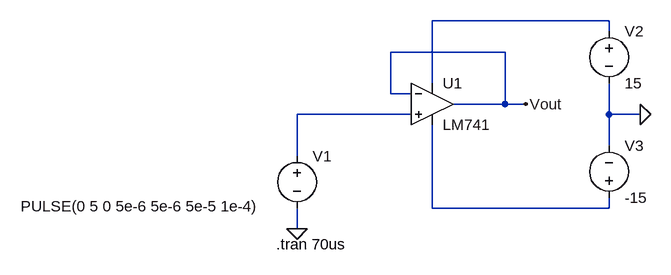
[diagram p0: schematic voltage_follower.asc]
voltage_follower.asc, the LTspice schematic file:
Version 4
SHEET 1 880 680
WIRE 480 32 208 32
WIRE 480 48 480 32
WIRE 320 80 144 80
WIRE 208 128 208 32
WIRE 144 144 144 80
WIRE 176 144 144 144
WIRE 320 160 320 80
WIRE 320 160 240 160
WIRE 352 160 320 160
WIRE 176 176 0 176
WIRE 480 176 480 128
WIRE 528 176 480 176
WIRE 480 224 480 176
WIRE 0 240 0 176
WIRE 208 320 208 192
WIRE 480 320 480 304
WIRE 480 320 208 320
WIRE 0 352 0 320
FLAG 528 176 0
FLAG 352 160 Vout
FLAG 0 352 0
SYMBOL OpAmps\\LM741 208 96 R0
SYMATTR InstName U1
SYMBOL voltage 0 224 R0
WINDOW 3 -425 93 Left 2
WINDOW 123 0 0 Left 0
WINDOW 39 0 0 Left 0
SYMATTR Value PULSE(0 5 0 5e-6 5e-6 5e-5 1e-4)
SYMATTR InstName V1
SYMBOL voltage 480 32 R0
WINDOW 123 0 0 Left 0
WINDOW 39 0 0 Left 0
SYMATTR InstName V2
SYMATTR Value 15
SYMBOL voltage 480 320 M180
WINDOW 0 24 96 Left 2
WINDOW 3 24 16 Left 2
WINDOW 123 0 0 Left 0
WINDOW 39 0 0 Left 0
SYMATTR InstName V3
SYMATTR Value -15
TEXT -32 376 Left 2 !.tran 70us

The netlist it stands for:
* voltage_follower.asc
XU1 N002 Vout N001 N003 Vout LM741  ; pins In+ In- V+ V- OUT
V1 N002 0 PULSE(0 5 0 5e-6 5e-6 5e-5 1e-4)
V2 N001 0 15
V3 N003 0 -15
.tran 70us
.lib LM741.lib
.backanno
.end